# EAGLE design Adafruit WINC1500 Breakout (EAGLE 6.6.0)
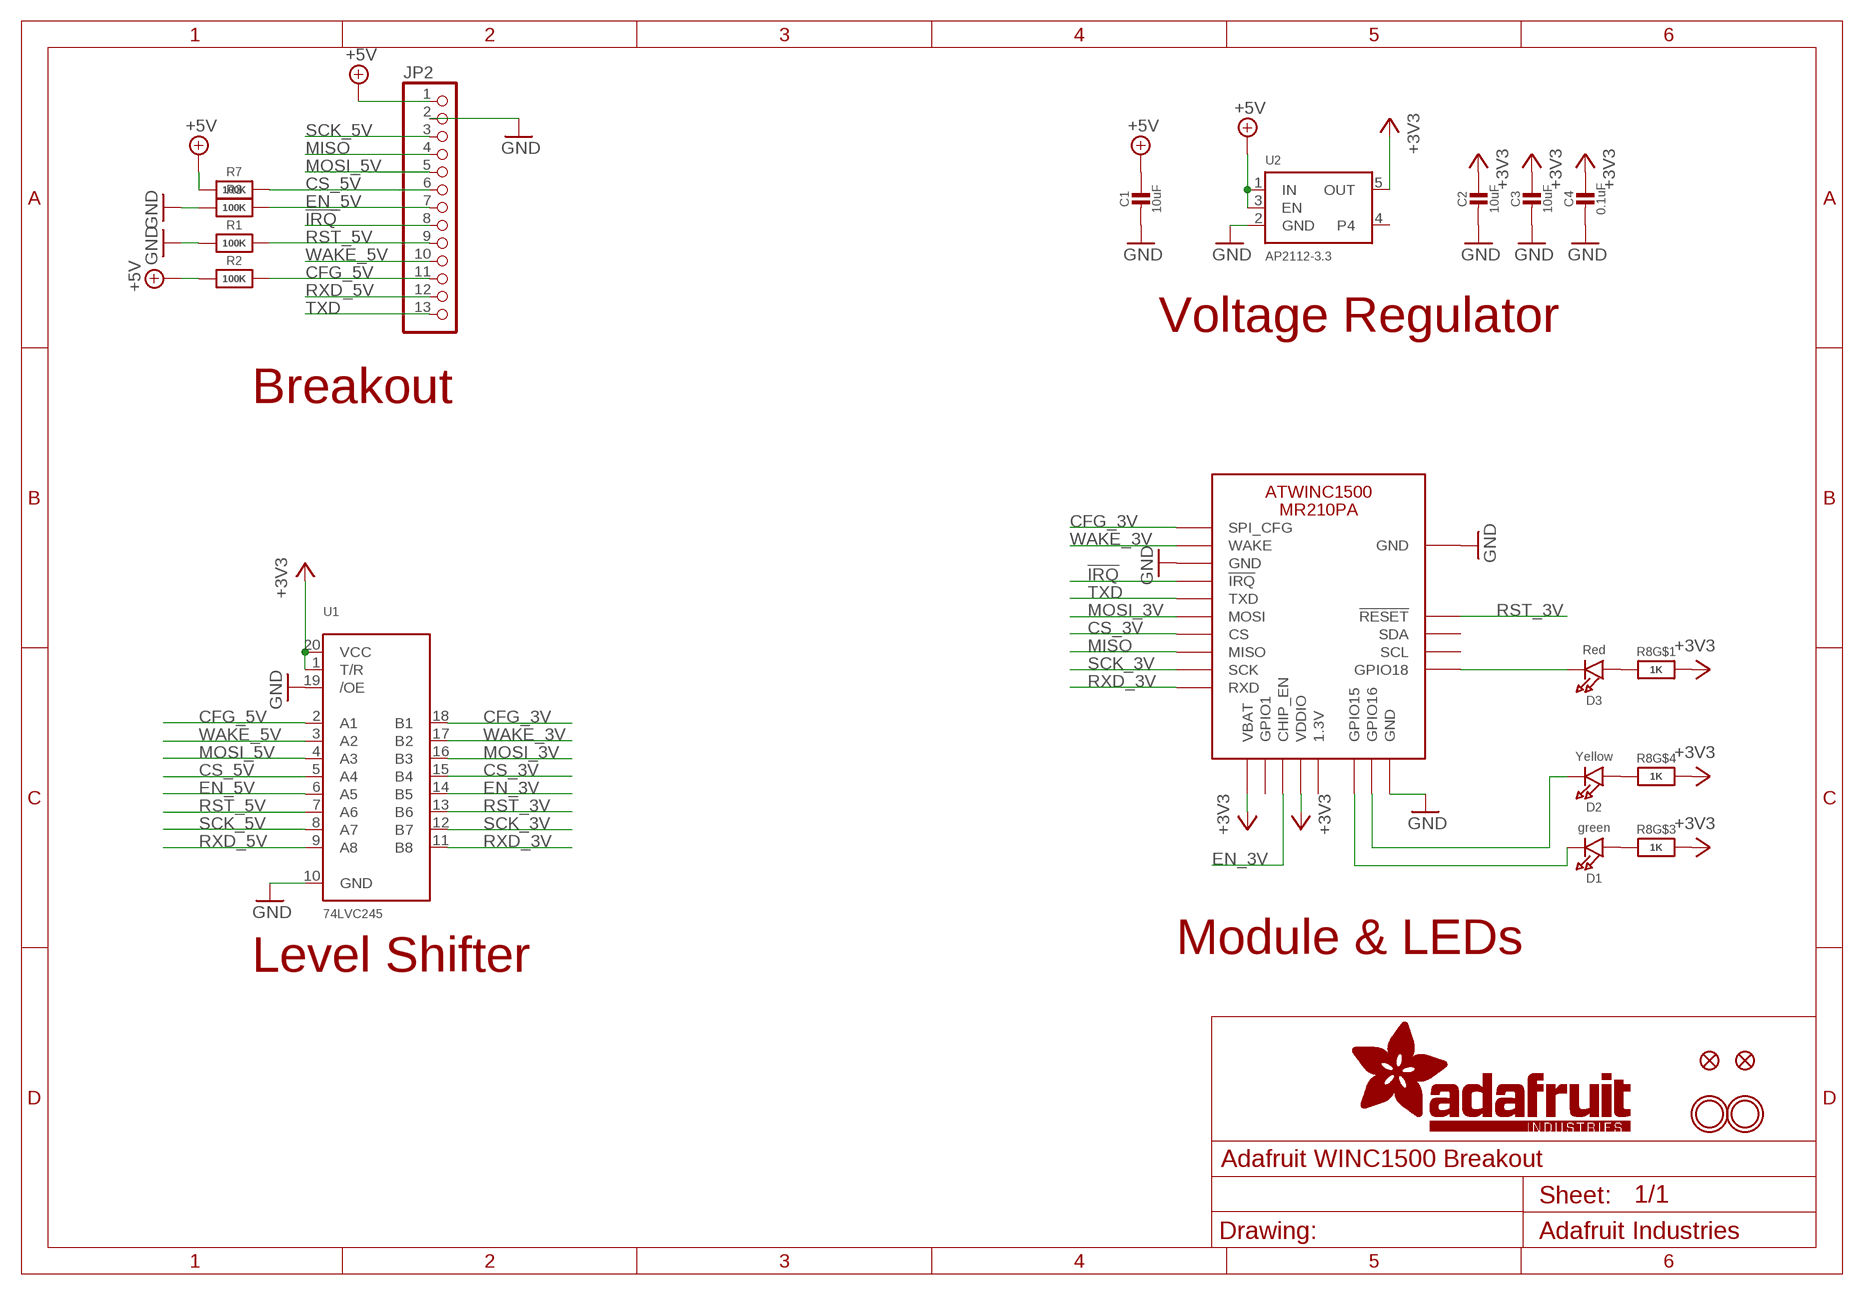
[diagram p0: schematic, sheet 1]

## Parts
C1  10uF  CAP_CERAMIC0805-NOOUTLINE  [0805-NO]
C2  10uF  CAP_CERAMIC0805_10MGAP  [0805_10MGAP]
C3  10uF  CAP_CERAMIC0805-NOOUTLINE  [0805-NO]
C4  0.1uF  CAP_CERAMIC0805-NOOUTLINE  [0805-NO]
D1  green  LED0805_NOOUTLINE  [CHIPLED_0805_NOOUTLINE]
D2  Yellow  LED0805_NOOUTLINE  [CHIPLED_0805_NOOUTLINE]
D3  Red  LED0805_NOOUTLINE  [CHIPLED_0805_NOOUTLINE]
FID1  FIDUCIAL""  [FIDUCIAL_1MM]
FID2  FIDUCIAL""  [FIDUCIAL_1MM]
JP2  HEADER-1X13  [1X13_ROUND_70]
R1  100K  RESISTOR0805_NOOUTLINE  [0805-NO]
R2  100K  RESISTOR0805_NOOUTLINE  [0805-NO]
R3  100K  RESISTOR_0805MP  [_0805MP]
R7  100K  RESISTOR_0805MP  [_0805MP]
R8  1K  RESISTOR_4PACK  [RESPACK_4X0603]
U1  74LVC245  74LCX245  [TSSOP20]
U2  AP2112-3.3  VREG_SOT23-5  [SOT23-5]
U$1  ATWINC1500_MR210PB  ATWINC1500_MR210PA  [ATWINC1500_MR210PA]
U$2  MOUNTINGHOLE2.5  [MOUNTINGHOLE_2.5_PLATED]
U$3  MOUNTINGHOLE2.5  [MOUNTINGHOLE_2.5_PLATED]

## Nets
!IRQ: JP2.8 U$1.J13(!IRQ)
+3V3: C2.1 C3.1 C4.1 R8.5 R8.6 R8.8 U1.1(T/R) U1.20(VCC) U2.5(OUT) U$1.J20(VBAT) U$1.J23(VDDIO)
+5V: C1.1 JP2.1 R2.1 R7.1 U2.1(IN) U2.3(EN)
CFG_3V: U1.18(B1) U$1.J10(SPI_CFG)
CFG_5V: JP2.11 R2.2 U1.2(A1)
CS_3V: U1.15(B4) U$1.J16(CS)
CS_5V: JP2.6 R7.2 U1.5(A4)
EN_3V: U1.14(B5) U$1.J22(CHIP_EN)
EN_5V: JP2.7 R3.2 U1.6(A5)
GND: C1.2 C2.2 C3.2 C4.2 JP2.2 R1.1 R3.1 U1.10(GND) U1.19(/OE) U2.2(GND) U$1.J9(GND) U$1.J12(GND) U$1.J28(GND) U$1.MTGND(GND)
GPIO15: D1.C U$1.J26(GPIO15)
GPIO16: D2.C U$1.J27(GPIO16)
GPIO18: D3.C U$1.J1(GPIO18)
MISO: JP2.4 U$1.J17(MISO)
MOSI_3V: U1.16(B3) U$1.J15(MOSI)
MOSI_5V: JP2.5 U1.4(A3)
N$4: D3.A R8.1
N$5: D2.A R8.4
N$6: D1.A R8.3
RST_3V: U1.13(B6) U$1.J4(!RESET)
RST_5V: JP2.9 R1.2 U1.7(A6)
RXD_3V: U1.11(B8) U$1.J19(RXD)
RXD_5V: JP2.12 U1.9(A8)
SCK_3V: U1.12(B7) U$1.J18(SCK)
SCK_5V: JP2.3 U1.8(A7)
TXD: JP2.13 U$1.J14(TXD)
WAKE_3V: U1.17(B2) U$1.J11(WAKE)
WAKE_5V: JP2.10 U1.3(A2)
Unconnected: R8.2 R8.7 U2.4 U$1.J2(SCL) U$1.J3(SDA) U$1.J21(GPIO1) U$1.J24(1.3V)

## Notes on the sheet
- Voltage Regulator
- Breakout
- Module & LEDs
- Level Shifter

## Library data of the parts
C1-C4 = microbuilder:CAP_CERAMIC: Ceramic Capacitors For new designs, use the packages preceded by an '_' character since they are more reliable: The following footprints should be used on most boards: _0402 - Standard footprint for regular board layouts _0603 - Standard footprint for regular board layouts _0805 - Standard footprint for regular board layouts _1206 - Standard footprint for regular board layouts For extremely tight-pitch boards where space is at a premium, the following 'micro-pitch' footprints can be used (smaller pads, no silkscreen outline, etc.): _0402MP - Micro-pitch footprint for very dense/compact boards _0603MP - Micro-pitch footprint for very dense/compact boards _0805MP - Micro-pitch footprint for very dense/compact boards _1206MP - Micro-pitch footprint for very dense/compact boards
D1-D3 = microbuilder:LED: LED 0603 - 0603 Surface Mount Package 2mA: Green LED - Low Power (3.9mcd, 2ma, 1.7Vf) - Digikey: 475-2709-2-ND Orange LED - Low Power (9.8mcd, 2ma, 1.8Vf) - Digikey: 475-1194-2-ND Red LED - Low Power (5mcd, 2ma, 1.8Vf) - Digikey: 475-1195-2-ND Yellow LED - Low Power (7mcd, 2ma, 1.8Vf) - Digikey: 475-1196-2-ND 5mA: Blue LED - Low Power (17mcd, 5ma, 2.9Vf) - Digikey: LNJ937W8CRACT-ND 0805 - 0805 Surface Mount Package 2mA: Red LED (8.8mcd, 2mA, 1.8Vf, Clear) - Low Power [Digikey: 475-2510-1-ND] Green LED (5mcd, 2mA, 1.8Vf, Clear) - Low Power [Digikey: 475-2730-1-ND] Yellow LED (11.3mcd, 2mA, 1.8Vf, Clear) - Low Power [Digikey: 475-2555-1-ND] 20mA: Red LED (104mcd, 20mA, Diffused) - LS R976 [Digikey: 475-1278-6-ND] Red LED (12mcd, 20mA, 2.0Vf, Clear) - APT2012EC [Digikey: 754-1128-1-ND] Green LED (15mcd, 20mA, 2.2Vf, Clear) - APT2012GC [Digikey: 754-1131-1-ND] Orange LED (160mcd, 20mA, 2.1Vf, Clear) - APT2012SECK [Digikey: 754-1130-1-ND] 1206 - 1206 Surface Mount Package Green LED (26mcd, 20mA, Diffused) - LG N971 [Digikey: 475-1407-6-ND] Red LED (15mcd, 20mA, Diffused) - LH N974 [Digikey: 475-1416-6-ND] Cree - Cree High-Power Surface Mount LEDs XPEBWT-L1-0000-00D50 - White 111lm 350mA 2.9Vf 6200K 110° XTEAWT-00-0000-00000LEE3 - White 114lm 350mA 2.85Vf 5000K 115° Everlight - Everlight 45-21 Series Surface Mount LEDs 45-21/QK2C-B2832AC2CB2/2T - Warm White 2000mcd 20mA 3.25Vf 3050K 120° 45-21/LK2C-B38452C4CB2/2T - Nuetral White 2000mcd 20mA 3.25Vf 4150K 120° 45-21/LK2C-B50634C6CB2/2T - Cold White 2200mcd 20mA 3.25Vf 5650K 120° PLCC2 Reverse Mount LS T77K-J1L2-1-0-2-R18-Z - Red 11.25mcd 2mA 1.8Vf 630nm 120° LO T77K-L1M2-24-Z - Orange 19.6mcd 2mA 1.8Vf 606nm 120° LY T77K-K2M1-26-Z - Yellow 15.7mcd 2mA 1.8Vf 587nm 120°
FID1 FID2 = microbuilder:FIDUCIAL: Fiducial Alignment Points Various fiducial points for machine vision alignment.; BOM: EXCLUDE
JP2 = microbuilder:HEADER-1X13
R1-R3 R7 = microbuilder:RESISTOR: Resistors For new designs, use the packages preceded by an '_' character since they are more reliable: The following footprints should be used on most boards: _0402 - Standard footprint for regular board layouts _0603 - Standard footprint for regular board layouts _0805 - Standard footprint for regular board layouts _1206 - Standard footprint for regular board layouts For extremely tight-pitch boards where space is at a premium, the following 'micro-pitch' footprints can be used (smaller pads, no silkscreen outline, etc.): _0402MP - Micro-pitch footprint for very dense/compact boards _0603MP - Micro-pitch footprint for very dense/compact boards _0805MP - Micro-pitch footprint for very dense/compact boards _1206MP - Micro-pitch footprint for very dense/compact boards
R8 = microbuilder:RESISTOR_4PACK: Resistor Packs (4 resistors) 4 x 0603 10K 1/16W - Digikey: YC164J-10KCT-ND
U1 = microbuilder:74LCX245: 74LCX245MTC - 5.0V Tolerant Bi-Directional Buffer Can be used to interface 5.0V logic to 2.5 or 3.3V devices Digikey: 74LCX245MTCXTR-ND Mouser: 512-74LCX245MTCX
U2 = microbuilder:VREG_SOT23-5: SOT23-5 Fixed Voltage Regulators Part Current Out V Out V In V Dropout θJA (°C/W) TJ (°C) Digikey Part No. ADP121 150mA 3.3V 3.4-5.5V 0.09V @ 150mA -- -- ADP121-AUJZ33R7CT-ND ADP121 150mA 3.0V 3.1-5.5V 0.09V @ 150mA -- -- ADP121-AUJZ30R7CT-ND ADP122 300mA 3.3V 3.4-5.5V 0.085V @ 300mA -- -- ADP122AUJZ-3.3-R7CT-ND ADP1712 300mA 3.3V 3.5-5.5V 0.17V @ 300mA -- -- ADP1712AUJZ-3.3-R7TR-ND AP7311 (Low Cost) 150mA 3.3V 3.5-6V 0.15V @ 150mA -- -- AP7311-33WG-7DICT-ND LD39015M18R 150mA 1.8V 1.9V-5.5V 0.08V @ 100mA -- -- 497-6977-1-ND LP2985A-33DBVR 150mA 3.3V 3.3-16V 0.28V @ 150mA 206 150 296-18479-1-ND MCP1824T-3302E/OT 300mA 3.3V 3.5V-6V 0.2V @ 300mA -- -- MCP1824T-3302E/OTCT-ND MIC5205-2.5YM5 TR 150mA 2.5V 2.7-16V 0.165V @ 150mA -- -- 576-1257-2-ND MIC5205-3.0YM5 TR 150mA 3.0V 3.2V-16V 0.165V @ 150mA -- -- 576-1258-2-ND MIC5205-3.3YM5 TR 150mA 3.3V 3.5V-16V 0.165V @ 150mA -- -- 576-1259-2-ND TPS780330220 150mA 3.3V+2.2V 3.6-5.5V 250mV Max -- -- 296-23332-1-ND TDA3663/N1,135 100mA 3.3V 3.5-45V 0.18V @ 50mA -- -- 568-5343-1-ND Max operating temp can be calculated using θJA, TJ (max junction temperature), and power in watts. Set the "Maximum Ambient Temperature" until it reaches TJ ("Max Junction Temperature"), which is the absolute limit for safe use of the regulator: Heat Sink Temperature Calculator <http://www.daycounter.com/Calculators/Heat-Sink-Temperature-Calculator.phtml> For example, With 12V source into a 3.3V LP2985 and a 30mA load, we are dissipating (12V-3.3V) * 0.03A = 0.261W. With a θJA of 206 °C/W, a TJ of 150°C, and 261mW we can safely use the chip without a heat sink up to 75°C (=147.1°C Junction Temperature).
U$1 = microbuilder:ATWINC1500_MR210PA: ATWINC1500_MR210PA wifi module
U$2 U$3 = microbuilder:MOUNTINGHOLE: Mounting Hole For #2 screws (0.086"/2.18mm width, 0.094"/2.4mm hole) use 2.5mm; BOM: EXCLUDE

## Board
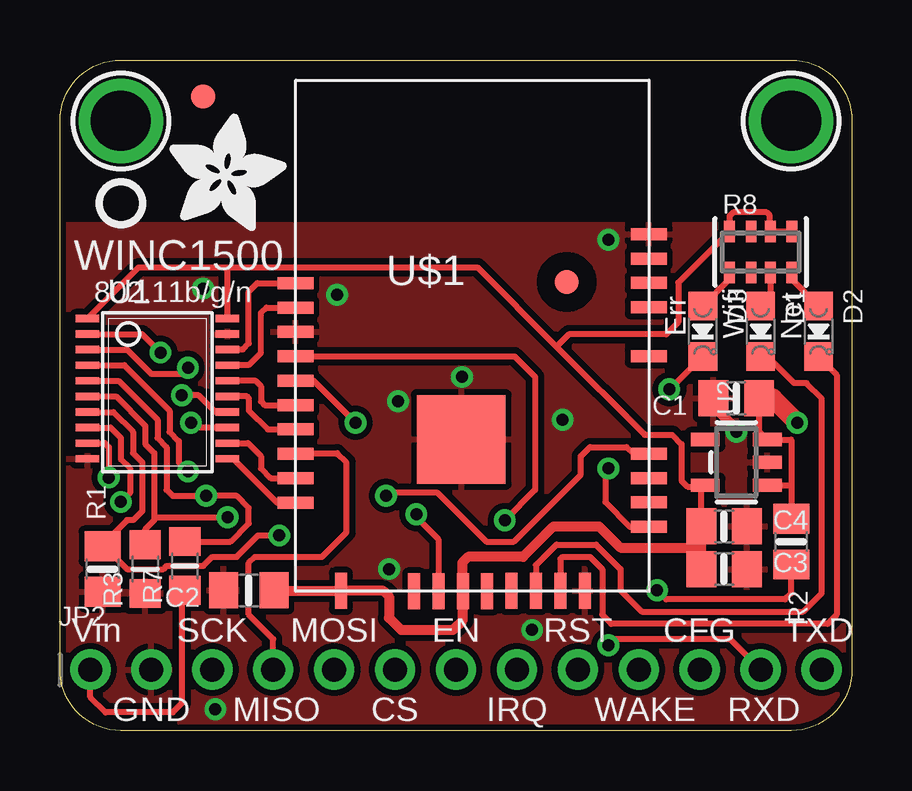
[diagram p1: board, top side]
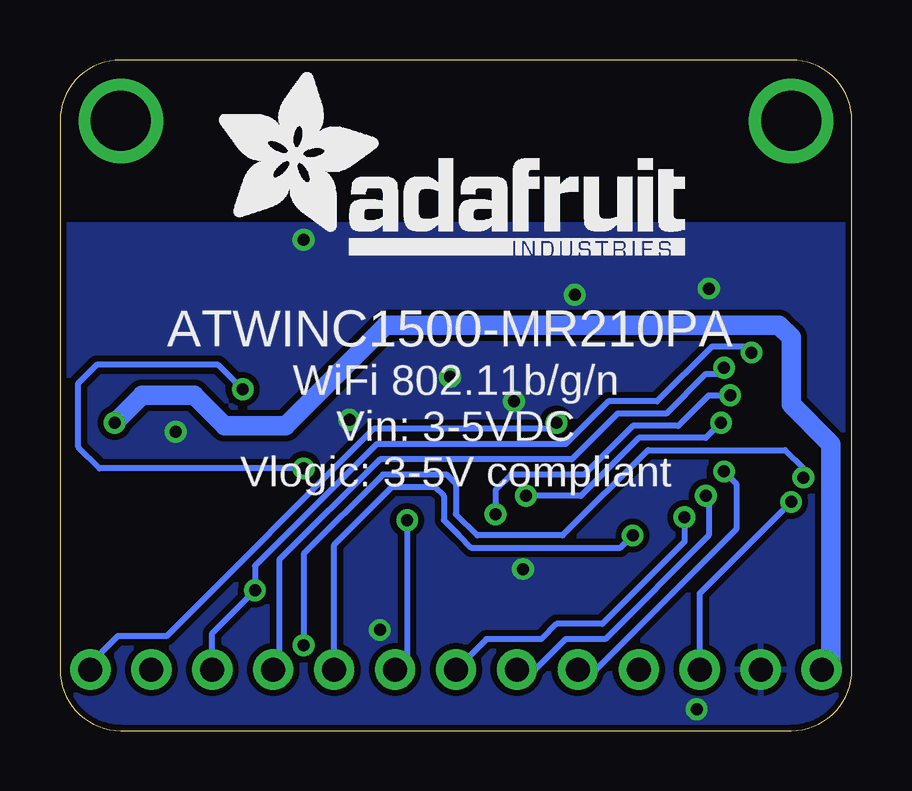
[diagram p2: board, bottom side, seen from below]

Size 33.02 x 27.94 mm. Coordinates in mm from the lower left corner, seen from the top.
Outline: 2.54,27.94 30.48,27.94 arc-90 33.02,25.4 33.02,2.54 arc-90 30.48,0 2.54,0 arc-90 0,2.54 0,25.4 arc-90 2.54,27.94
Copper layers (1*16): Top 0.035mm / dielectric 1.5mm / Bottom 0.035mm
Design rules "adafruit *": minimum track width 8mil, minimum drill 15.5mil, track to track 8mil, track to pad 8mil, pad to pad 8mil, via to via 8mil, smd to smd 8mil, copper to edge 10mil, drill to drill 8mil, minimum pad ring 10mil, minimum via ring 8mil, stop-mask expansion 2mil, vias tented up to drill 20mil, thermal gap 10mil

### Footprints (pad centres in the part's own frame; a part is rotated, then mirrored left to right if it is on the bottom)
0805-NO = smd 1.24 x 1.5: 1 -0.95,0; 2 0.95,0
0805_10MGAP = smd 1.2 x 1.5: 1 -1.05,0; 2 1.05,0
CHIPLED_0805_NOOUTLINE = smd 1.2 x 1.2: A 0,-1.05; C 0,1.05
FIDUCIAL_1MM = smd 1 x 1: 1 0,0
1X13_ROUND_70 = drill 1 pad 1.676: 1 -15.24,0; 2 -12.7,0; 3 -10.16,0; 4 -7.62,0; 5 -5.08,0; 6 -2.54,0; 7 0,0; 8 2.54,0; 9 5.08,0; 10 7.62,0; 11 10.16,0; 12 12.7,0; 13 15.24,0
_0805MP = smd 1.2 x 1.3: 1 -1.016,0; 2 1.016,0
RESPACK_4X0603 = smd 0.45 x 0.9: 1 -1.3,-0.85; 2 -0.4,-0.85; 3 0.4,-0.85; 4 1.3,-0.85; 5 1.3,0.85; 6 0.4,0.85; 7 -0.4,0.85; 8 -1.3,0.85
TSSOP20 = smd 0.305 x 0.991: 1 -3.075,-2.918; 2 -2.425,-2.918; 3 -1.775,-2.918; 4 -1.125,-2.918; 5 -0.475,-2.918; 6 0.175,-2.918; 7 0.825,-2.918; 8 1.475,-2.918; 9 2.125,-2.918; 10 2.775,-2.918; 11 2.775,2.918; 12 2.125,2.918; 13 1.475,2.918; 14 0.825,2.918; 15 0.175,2.918; 16 -0.475,2.918; 17 -1.125,2.918; 18 -1.775,2.918; 19 -2.425,2.918; 20 -3.075,2.918
SOT23-5 = smd 0.55 x 1.2: 1 -0.95,-1.3; 2 0,-1.3; 3 0.95,-1.3; 4 0.95,1.3; 5 -0.95,1.3
ATWINC1500_MR210PA = smd 1.5 x 0.5: J1 7.146,-4.973; J2 7.146,-3.957; J3 7.146,-2.941; J4 7.146,-1.925; J5 7.146,2.139; J6 7.146,4.171; J7 7.146,5.187; J8 7.146,6.203; J9 7.146,7.219; J10 -7.584,5.181; J11 -7.584,4.165; J12 -7.584,3.149; J13 -7.584,2.133; J14 -7.584,1.117; J15 -7.584,0.101; J16 -7.584,-0.915; J17 -7.584,-1.931; J18 -7.584,-2.947; J19 -7.584,-3.963 | smd 0.5 x 1.5: J20 -5.684,-7.643; J21 -2.636,-7.663; J22 -1.62,-7.663; J23 -0.604,-7.663; J24 0.412,-7.663; J25 1.428,-7.643; J26 2.444,-7.643; J27 3.46,-7.643; J28 4.476,-7.643 | smd 3.7 x 3.7: MTGND -0.666,-1.331
MOUNTINGHOLE_2.5_PLATED = drill 2.5 pad 3.2: P$1 0,0

### Placement (x,y rotation side)
C1  28.19,13.84 180 top
C2  7.87,5.84 180 top
C3  27.69,6.73 0 top
C4  27.69,8.51 0 top
D1  29.21,16.64 180 top
D2  31.62,16.64 180 top
D3  26.8,16.64 180 top
FID1  5.97,26.42 0 top
FID2  21.12,18.69 0 top
JP2  16.51,2.54 0 top
R1  1.78,6.73 90 top
R2  30.48,7.87 270 top
R3  3.56,6.73 90 top
R7  5.21,6.86 90 top
R8  29.21,19.94 0 top
U1  4.06,14.1 270 top
U2  28.19,11.18 90 top
U$1  17.4,13.46 0 top
U$2  2.54,25.4 0 top
U$3  30.48,25.4 0 top
U$4  [ADAFRUIT_5MM]  4.57,20.83 0 top
U$5  [PCBFEAT-REV-040]  2.54,21.97 0 top
U$6  [ADAFRUIT_TEXT_20MM]  26.54,19.81 0 bottom

### Tracks (layer width: path | path; a pad name or v marks a point on that pad's centre or on a via)
!IRQ  (via drill 0.5)
  Top 0.254: U$1.J13 18.95,15.6 19.81,14.73 19.81,10.03 v18.54,8.76
  Bottom 0.254: v18.54,8.76 18.54,3.05 JP2.8
+3V3
  Top 0.254: U1.20 6.98,19.18 6.86,19.3 | 6.86,19.3 3.28,19.3 U1.1 | 6.86,19.3 17.4,19.3 20.7,16 | 20.7,16 24.38,12.32 25.53,12.32 25.91,11.94 25.91,10.41 26.16,10.16 26.83,10.16 U2.5 26.74,10.07 C4.1 | R8.5 R8.6 29.59,20.81 29.59,21.46 29.46,21.59 28.07,21.59 27.91,21.43 R8.8 25.78,18.66 25.78,17.02 25.27,16.51 21.21,16.51 20.7,16
  Top 0.406: C3.1 C4.1 26.74,7.69 26.67,7.62 23.37,7.62 22.48,8.51 20.57,8.51 19.3,7.24 17.02,7.24 16.76,6.99 16.76,5.83 U$1.J23 16.8,4.6 16.38,4.19 14.22,4.19 13.72,4.7 13.72,5.59 13.48,5.82 U$1.J20 8.95,5.82 C2.1
+5V  (via drill 0.5)
  Top 0.254: C1.1 29.14,12.48 U2.3 30.48,12.13 30.48,10.23 | R7.1 5.08,5.71 5.08,1.14 4.7,0.76 1.91,0.76 1.27,1.4 JP2.1 | 30.48,10.23 R2.1 | U2.1 30.48,10.23
  Top 0.813: C1.1 29.72,13.84 v30.73,12.83
  Bottom 0.813: JP2.1 0.89,2.92 0.89,11.94 2.54,13.59 2.54,16.38 3.05,16.89 19.43,16.89 23.62,12.7 26.16,12.7 27.43,13.97 29.59,13.97 v30.73,12.83
CFG_3V
  Top 0.254: U1.18 7.62,15.87 7.87,16.13 7.87,18.29 8.23,18.64 U$1.J10
CFG_5V  (via drill 0.5)
  Top 0.254: U1.2 3.42,16.52 v4.19,15.75 | R2.2 30.48,5.71 30.23,5.46 25.27,5.46 v24.89,5.84
  Bottom 0.254: v4.19,15.75 4.45,16 5.84,16 8.13,13.72 10.16,13.72 11.94,11.94 19.81,11.94 24.89,6.86 v24.89,5.84 26.67,4.06 JP2.11
CS_3V
  Top 0.254: U1.15 7.79,13.92 7.87,13.84 7.87,13.34 8.66,12.55 U$1.J16
CS_5V  (via drill 0.5)
  Top 0.254: U1.5 2.45,14.57 4.06,12.95 4.06,12.19 4.45,11.81 4.45,10.03 4.7,9.78 v6.1,9.78 7.37,9.78 7.87,9.27 7.87,8.64 7.11,7.87 R7.2
  Bottom 0.254: v6.1,9.78 5.97,9.78 5.97,8.13 10.29,3.81 11.94,3.81 13.21,2.54 JP2.6
EN_3V  (via drill 0.5)
  Top 0.254: U1.14 6.49,13.27 5.79,13.97 v5.08,13.97 | U$1.J22 15.78,7.97 14.86,8.89 v14.86,9.02
  Bottom 0.254: v14.86,9.02 14.86,10.03 14.22,10.67 11.18,10.67 9.14,12.7 7.24,12.7 5.97,13.97 v5.08,13.97
EN_5V  (via drill 0.5)
  Top 0.254: U1.6 2.33,13.92 3.56,12.7 3.56,11.94 3.94,11.56 3.94,8.89 | 3.94,8.89 v6.99,8.89 | 3.94,8.89 3.94,8.76 3.56,8.38 R3.2
  Bottom 0.254: 6.99,9.14 v6.99,8.89 6.99,7.87 10.41,4.45 12.32,4.45 12.95,3.81 15.24,3.81 JP2.7
GND  (via drill 0.5)
  Top 0.406: C1.2 27.24,13.52 28.19,12.57
  other vias: 5.97,18.41 11.56,18.16 22.86,20.45 16.76,14.73 6.48,0.89 28.19,12.45 19.68,4.19 13.72,6.73 14.1,13.72 20.95,12.95
  pour Bottom (isolate 0.254): 0,2.54 arc90 2.54,0 30.48,0 arc90 33.02,2.54 33.02,21.08 0,21.08
  pour Top (isolate 0.254): 0,2.54 0,21.08 33.02,21.08 33.02,2.54 arc-90 30.48,0 2.54,0 arc-90
GPIO15
  Top 0.254: D1.C 29.5,15.59 30.61,14.48 31.11,14.48 31.75,13.84 31.75,5.71 30.99,4.95 24.26,4.95 23.37,5.84 23.37,6.73 22.35,7.75 20.7,7.75 19.84,6.89 U$1.J26
GPIO16
  Top 0.254: D2.C 32.38,14.82 32.38,4.83 32,4.45 22.99,4.45 22.61,4.83 22.61,6.73 22.1,7.24 20.95,7.24 20.86,7.14 U$1.J27
GPIO18  (via drill 0.5)
  Top 0.254: v22.86,10.92 22.86,10.79 22.73,10.67 22.73,9.53 23.77,8.49 U$1.J1 | D3.C 25.43,14.22 v25.4,14.22
  Bottom 0.254: v22.86,10.92 31.37,10.92 32.26,11.81 32.26,14.48 31.5,15.24 26.42,15.24 v25.4,14.22
MISO
  Top 0.254: JP2.4 8.89,3.81 7.87,4.83 7.87,6.99 8.13,7.24 10.92,7.24 11.94,8.26 11.94,11.18 11.56,11.56 11.53,11.53 U$1.J17
MOSI_3V
  Top 0.254: U1.16 8.16,14.57 8.38,14.35 8.38,13.72 8.54,13.56 U$1.J15
MOSI_5V  (via drill 0.5)
  Top 0.254: U1.4 2.69,15.22 4.57,13.34 4.57,12.45 4.95,12.06 4.95,11.18 v5.33,10.79
  Bottom 0.254: JP2.5 10.67,2.54 4.83,8.38 4.83,10.29 v5.33,10.79
N$4
  Top 0.254: R8.1 27.91,18.8 D3.A
N$5
  Top 0.254: R8.4 30.51,18.8 D2.A
N$6
  Top 0.254: R8.3 29.61,18.09 D1.A
RST_3V  (via drill 0.5)
  Top 0.254: U1.13 5.67,12.62 v5.46,12.83 | v13.59,9.78 13.72,9.91 15.75,9.91 17.78,7.87 18.92,7.87 21.72,10.67 21.72,11.43 22.1,11.81 23.62,11.81 23.9,11.54 U$1.J4
  Bottom 0.254: v13.59,9.78 11.3,9.78 8.89,12.19 6.1,12.19 v5.46,12.83
RST_5V  (via drill 0.5)
  Top 0.254: U1.7 2.22,13.27 3.05,12.45 3.05,11.56 3.43,11.18 3.43,9.14 3.05,8.76 2.79,8.76 1.78,7.75 | v9.14,8.13 8.26,8.13 7.37,7.24 6.35,7.24 5.97,6.86 4.45,6.86 4.32,6.73 2.79,6.73 1.78,7.75 | 1.78,7.75 R1.2
  Bottom 0.254: JP2.9 21.59,7.75 19.18,10.16 17.4,10.16 17.02,9.78 17.02,8.76 16.38,8.13 15.88,7.62 9.65,7.62 v9.14,8.13
RXD_3V
  Top 0.254: U1.11 7.22,11.32 9.04,9.5 U$1.J19
RXD_5V  (via drill 0.5)
  Top 0.254: U1.9 1.87,11.97 2.03,11.81 v2.03,10.54 | JP2.12 27.94,3.81 23.11,3.81 v22.86,3.56
  Bottom 0.254: v22.86,3.56 22.86,7.37 19.56,10.67 16.89,10.67 16.51,10.29 16.51,9.02 15.62,8.13 12.06,8.13 8.51,11.68 2.79,11.68 2.03,10.92 v2.03,10.54
SCK_3V
  Top 0.254: U1.12 7.84,11.97 8.38,11.43 8.38,10.92 8.79,10.52 U$1.J18
SCK_5V  (via drill 0.5)
  Top 0.254: U1.8 2.11,12.62 2.54,12.19 2.54,11.3 2.92,10.92 2.92,9.91 v2.54,9.53
  Bottom 0.254: JP2.3 6.35,5.71 v2.54,9.53
TXD  (via drill 0.5)
  Top 0.254: v12.32,12.83 10.57,14.58 U$1.J14
  Bottom 0.254: v12.32,12.83 12.57,12.57 19.94,12.57 28.57,3.94 30.61,3.94 31.75,2.79 JP2.13
WAKE_3V
  Top 0.254: U1.17 7.86,15.22 8.38,15.75 8.38,17.4 8.61,17.63 U$1.J11
WAKE_5V  (via drill 0.5)
  Top 0.254: U1.3 2.8,15.87 3.81,14.86 5.08,14.86 v5.33,15.11
  Bottom 0.254: JP2.10 23.88,2.79 23.88,7.11 19.68,11.3 11.68,11.3 9.78,13.21 7.75,13.21 6.1,14.86 5.59,14.86 v5.33,15.11

### Text on the board
tPlace: WINC1500 | 802.11b/g/n | Err | Wifi | Net | Vin | SCK | MOSI | EN | RST | CFG | TXD | GND | MISO | CS | IRQ | WAKE | RXD
bPlace: ATWINC1500-MR210PA | WiFi 802.11b/g/n / Vin: 3-5VDC / Vlogic: 3-5V compliant